# EAGLE design frdm (EAGLE 7.5.0)
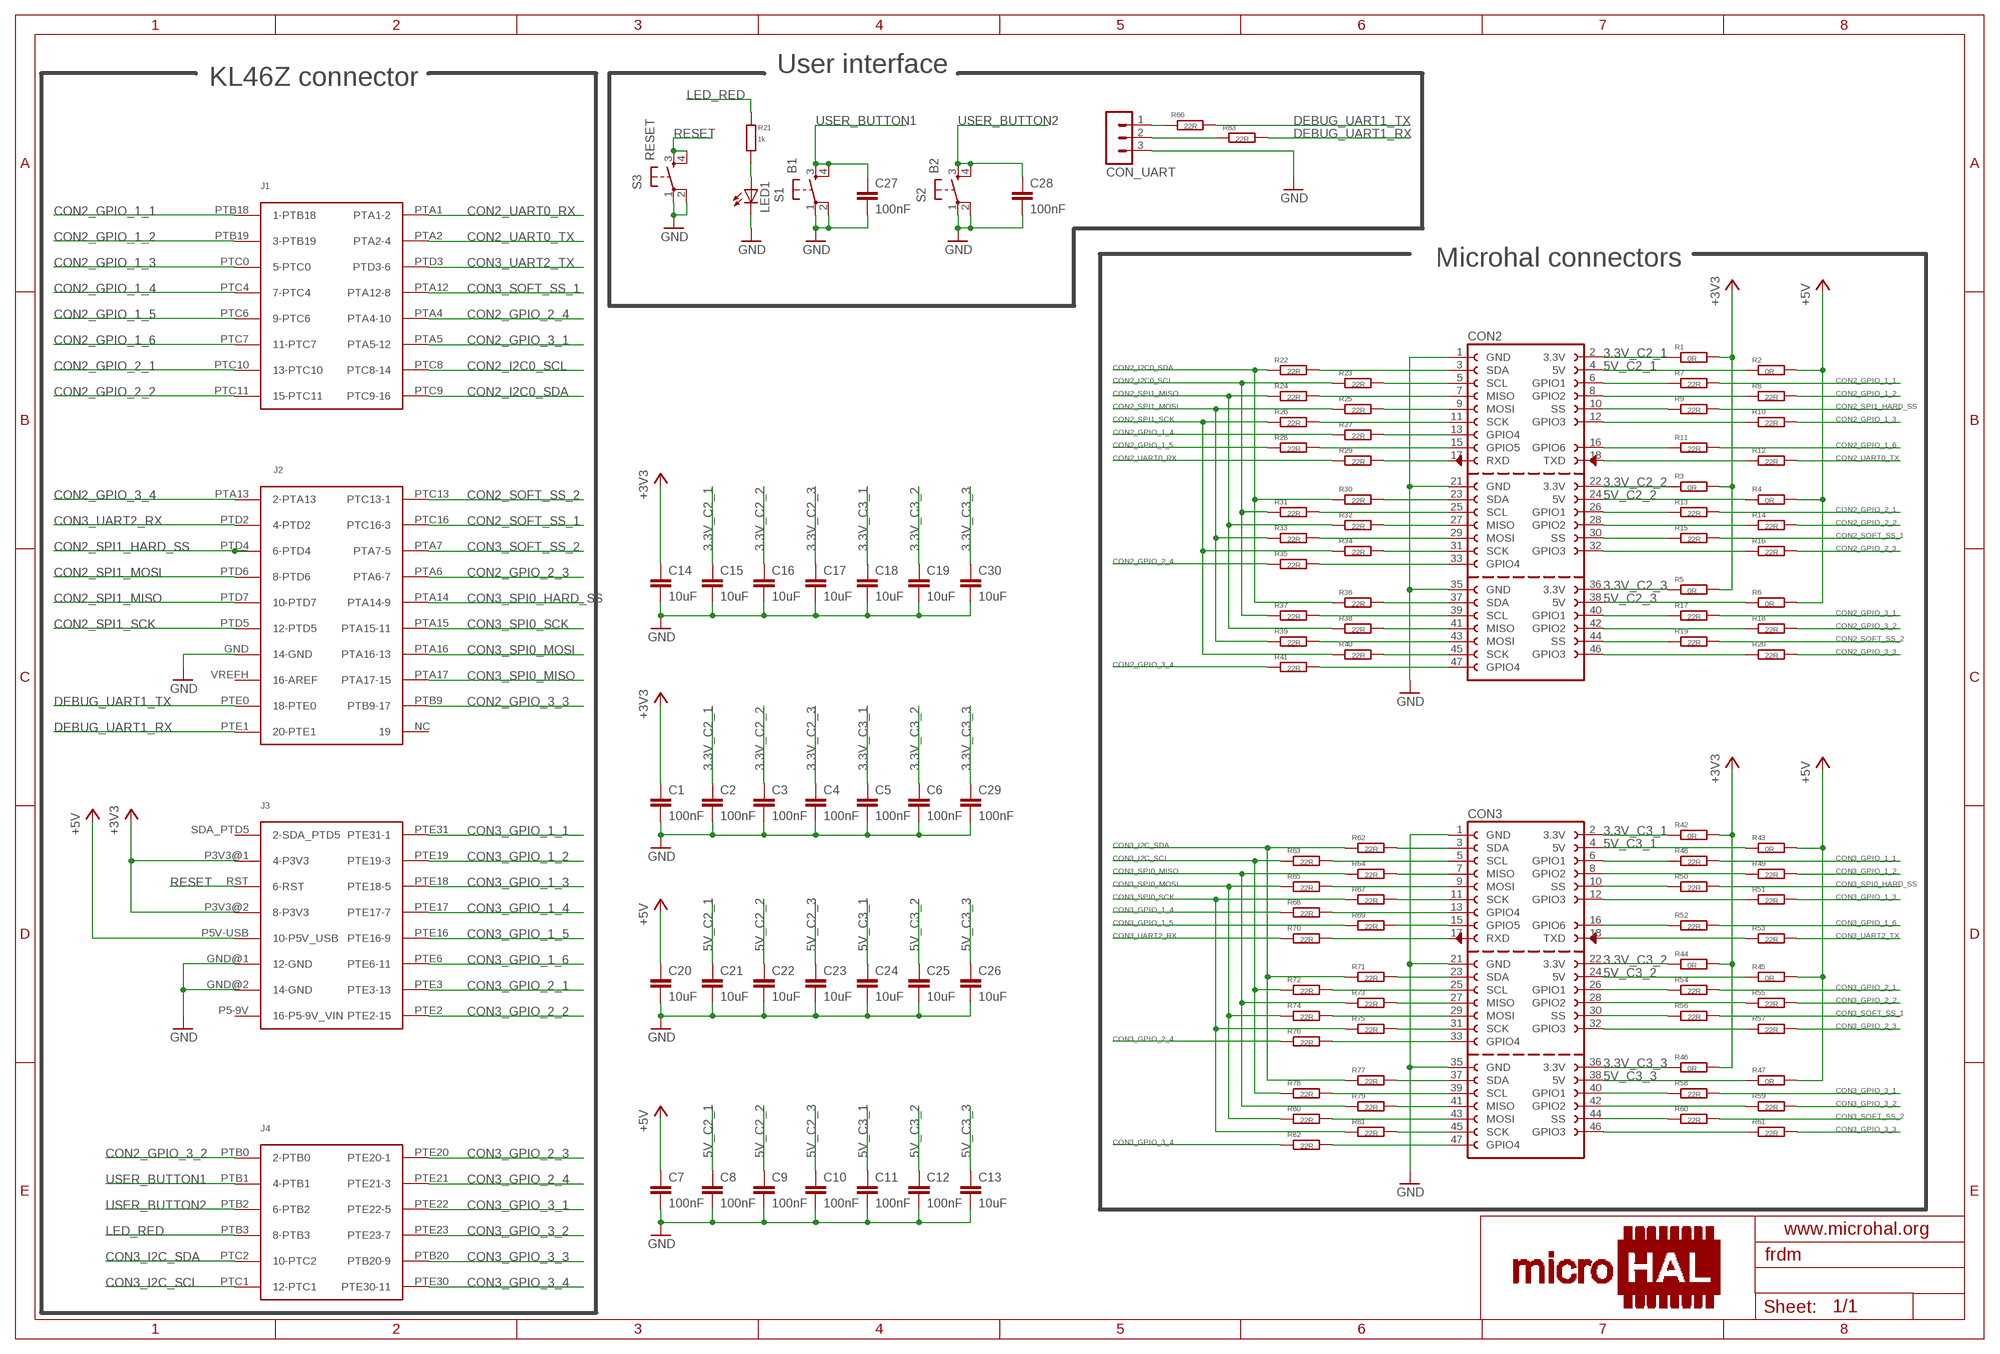
[diagram p0: schematic, sheet 1]

## Parts
C1  100nF  C-EUC0603K  [C0603K]
C2  100nF  C-EUC0603K  [C0603K]
C3  100nF  C-EUC0603K  [C0603K]
C4  100nF  C-EUC0603K  [C0603K]
C5  100nF  C-EUC0603K  [C0603K]
C6  100nF  C-EUC0603K  [C0603K]
C7  100nF  C-EUC0603K  [C0603K]
C8  100nF  C-EUC0603K  [C0603K]
C9  100nF  C-EUC0603K  [C0603K]
C10  100nF  C-EUC0603K  [C0603K]
C11  100nF  C-EUC0603K  [C0603K]
C12  100nF  C-EUC0603K  [C0603K]
C13  10uF  C-EUC0603K  [C0603K]
C14  10uF  C-EUC0603K  [C0603K]
C15  10uF  C-EUC0603K  [C0603K]
C16  10uF  C-EUC0603K  [C0603K]
C17  10uF  C-EUC0603K  [C0603K]
C18  10uF  C-EUC0603K  [C0603K]
C19  10uF  C-EUC0603K  [C0603K]
C20  10uF  C-EUC0603K  [C0603K]
C21  10uF  C-EUC0603K  [C0603K]
C22  10uF  C-EUC0603K  [C0603K]
C23  10uF  C-EUC0603K  [C0603K]
C24  10uF  C-EUC0603K  [C0603K]
C25  10uF  C-EUC0603K  [C0603K]
C26  10uF  C-EUC0603K  [C0603K]
C27  100nF  C-EUC0603K  [C0603K]
C28  100nF  C-EUC0603K  [C0603K]
C29  100nF  C-EUC0603K  [C0603K]
C30  10uF  C-EUC0603K  [C0603K]
CON1  FRDM_BASE  [FRDM_BASE]
CON2  MICROHAL_CONNECTOR_F_3  [MICROHAL_CONNECTOR_F_3]
CON3  MICROHAL_CONNECTOR_F_3  [MICROHAL_CONNECTOR_F_3]
CON_UART  MA03-1  [MA03-1]
LED1  LEDCHIPLED_0603  [CHIPLED_0603]
R1  0R  R-EU_R0603  [R0603]
R2  0R  R-EU_R0603  [R0603]
R3  0R  R-EU_R0603  [R0603]
R4  0R  R-EU_R0603  [R0603]
R5  0R  R-EU_R0603  [R0603]
R6  0R  R-EU_R0603  [R0603]
R7  22R  R-EU_R0603  [R0603]
R8  22R  R-EU_R0603  [R0603]
R9  22R  R-EU_R0603  [R0603]
R10  22R  R-EU_R0603  [R0603]
R11  22R  R-EU_R0603  [R0603]
R12  22R  R-EU_R0603  [R0603]
R13  22R  R-EU_R0603  [R0603]
R14  22R  R-EU_R0603  [R0603]
R15  22R  R-EU_R0603  [R0603]
R16  22R  R-EU_R0603  [R0603]
R17  22R  R-EU_R0603  [R0603]
R18  22R  R-EU_R0603  [R0603]
R19  22R  R-EU_R0603  [R0603]
R20  22R  R-EU_R0603  [R0603]
R21  1k  R-EU_R0603  [R0603]
R22  22R  R-EU_R0603  [R0603]
R23  22R  R-EU_R0603  [R0603]
R24  22R  R-EU_R0603  [R0603]
R25  22R  R-EU_R0603  [R0603]
R26  22R  R-EU_R0603  [R0603]
R27  22R  R-EU_R0603  [R0603]
R28  22R  R-EU_R0603  [R0603]
R29  22R  R-EU_R0603  [R0603]
R30  22R  R-EU_R0603  [R0603]
R31  22R  R-EU_R0603  [R0603]
R32  22R  R-EU_R0603  [R0603]
R33  22R  R-EU_R0603  [R0603]
R34  22R  R-EU_R0603  [R0603]
R35  22R  R-EU_R0603  [R0603]
R36  22R  R-EU_R0603  [R0603]
R37  22R  R-EU_R0603  [R0603]
R38  22R  R-EU_R0603  [R0603]
R39  22R  R-EU_R0603  [R0603]
R40  22R  R-EU_R0603  [R0603]
R41  22R  R-EU_R0603  [R0603]
R42  0R  R-EU_R0603  [R0603]
R43  0R  R-EU_R0603  [R0603]
R44  0R  R-EU_R0603  [R0603]
R45  0R  R-EU_R0603  [R0603]
R46  0R  R-EU_R0603  [R0603]
R47  0R  R-EU_R0603  [R0603]
R48  22R  R-EU_R0603  [R0603]
R49  22R  R-EU_R0603  [R0603]
R50  22R  R-EU_R0603  [R0603]
R51  22R  R-EU_R0603  [R0603]
R52  22R  R-EU_R0603  [R0603]
R53  22R  R-EU_R0603  [R0603]
R54  22R  R-EU_R0603  [R0603]
R55  22R  R-EU_R0603  [R0603]
R56  22R  R-EU_R0603  [R0603]
R57  22R  R-EU_R0603  [R0603]
R58  22R  R-EU_R0603  [R0603]
R59  22R  R-EU_R0603  [R0603]
R60  22R  R-EU_R0603  [R0603]
R61  22R  R-EU_R0603  [R0603]
R62  22R  R-EU_R0603  [R0603]
R63  22R  R-EU_R0603  [R0603]
R64  22R  R-EU_R0603  [R0603]
R65  22R  R-EU_R0603  [R0603]
R66  22R  R-EU_R0603  [R0603]
R67  22R  R-EU_R0603  [R0603]
R68  22R  R-EU_R0603  [R0603]
R69  22R  R-EU_R0603  [R0603]
R70  22R  R-EU_R0603  [R0603]
R71  22R  R-EU_R0603  [R0603]
R72  22R  R-EU_R0603  [R0603]
R73  22R  R-EU_R0603  [R0603]
R74  22R  R-EU_R0603  [R0603]
R75  22R  R-EU_R0603  [R0603]
R76  22R  R-EU_R0603  [R0603]
R77  22R  R-EU_R0603  [R0603]
R78  22R  R-EU_R0603  [R0603]
R79  22R  R-EU_R0603  [R0603]
R80  22R  R-EU_R0603  [R0603]
R81  22R  R-EU_R0603  [R0603]
R82  22R  R-EU_R0603  [R0603]
R83  22R  R-EU_R0603  [R0603]
S1  B1  SWITCH_TACT_6X6_SMD  [SWITCH_TACT_6X6_SMD]
S2  B2  SWITCH_TACT_6X6_SMD  [SWITCH_TACT_6X6_SMD]
S3  RESET  SWITCH_TACT_6X6_SMD  [SWITCH_TACT_6X6_SMD]

## Nets
3.3V_C2_1: C2.1 C15.1 CON2.2(3.3V) R1.1
3.3V_C2_2: C3.1 C16.1 CON2.22(3.3V) R3.1
3.3V_C2_3: C4.1 C17.1 CON2.36(3.3V) R5.1
3.3V_C3_1: C5.1 C18.1 CON3.2(3.3V) R42.1
3.3V_C3_2: C6.1 C19.1 CON3.22(3.3V) R44.1
3.3V_C3_3: C29.1 C30.1 CON3.36(3.3V) R46.1
5V_C2_1: C8.1 C21.1 CON2.4(5V) R2.1
5V_C2_2: C9.1 C22.1 CON2.24(5V) R4.1
5V_C2_3: C10.1 C23.1 CON2.38(5V) R6.1
5V_C3_1: C11.1 C24.1 CON3.4(5V) R43.1
5V_C3_2: C12.1 C25.1 CON3.24(5V) R45.1
5V_C3_3: C13.1 C26.1 CON3.38(5V) R47.1
+3V3: C1.1 C14.1 CON1.P3V3@1(4-P3V3) CON1.P3V3@2(8-P3V3) R1.2 R3.2 R5.2 R42.2 R44.2 R46.2
+5V: C7.1 C20.1 CON1.P5V-USB(10-P5V_USB) R2.2 R4.2 R6.2 R43.2 R45.2 R47.2
CON2_GPIO_1_1: CON1.PTB18(1-PTB18) R7.2
CON2_GPIO_1_2: CON1.PTB19(3-PTB19) R8.2
CON2_GPIO_1_3: CON1.PTC0(5-PTC0) R10.2
CON2_GPIO_1_4: CON1.PTC4(7-PTC4) R27.1
CON2_GPIO_1_5: CON1.PTC6(9-PTC6) R28.1
CON2_GPIO_1_6: CON1.PTC7(11-PTC7) R11.2
CON2_GPIO_2_1: CON1.PTC10(13-PTC10) R13.2
CON2_GPIO_2_2: CON1.PTC11(15-PTC11) R14.2
CON2_GPIO_2_3: CON1.PTA6(PTA6-7) R16.2
CON2_GPIO_2_4: CON1.PTA4(PTA4-10) R35.1
CON2_GPIO_3_1: CON1.PTA5(PTA5-12) R17.2
CON2_GPIO_3_2: CON1.PTB0(2-PTB0) R18.2
CON2_GPIO_3_3: CON1.PTB9(PTB9-17) R20.2
CON2_GPIO_3_4: CON1.PTA13(2-PTA13) R41.1
CON2_I2C0_SCL: CON1.PTC8(PTC8-14) R23.1 R31.1 R37.1
CON2_I2C0_SDA: CON1.PTC9(PTC9-16) R22.1 R30.1 R36.1
CON2_SOFT_SS_1: CON1.PTC16(PTC16-3) R15.2
CON2_SOFT_SS_2: CON1.PTC13(PTC13-1) R19.2
CON2_SPI1_HARD_SS: CON1.PTD4(6-PTD4) R9.2
CON2_SPI1_MISO: CON1.PTD7(10-PTD7) R24.1 R32.1 R38.1
CON2_SPI1_MOSI: CON1.PTD6(8-PTD6) R25.1 R33.1 R39.1
CON2_SPI1_SCK: CON1.PTD5(12-PTD5) R26.1 R34.1 R40.1
CON2_UART0_RX: CON1.PTA1(PTA1-2) R29.1
CON2_UART0_TX: CON1.PTA2(PTA2-4) R12.2
CON3_GPIO_1_1: CON1.PTE31(PTE31-1) R48.2
CON3_GPIO_1_2: CON1.PTE19(PTE19-3) R49.2
CON3_GPIO_1_3: CON1.PTE18(PTE18-5) R51.2
CON3_GPIO_1_4: CON1.PTE17(PTE17-7) R68.1
CON3_GPIO_1_5: CON1.PTE16(PTE16-9) R69.1
CON3_GPIO_1_6: CON1.PTE6(PTE6-11) R52.2
CON3_GPIO_2_1: CON1.PTE3(PTE3-13) R54.2
CON3_GPIO_2_2: CON1.PTE2(PTE2-15) R55.2
CON3_GPIO_2_3: CON1.PTE20(PTE20-1) R57.2
CON3_GPIO_2_4: CON1.PTE21(PTE21-3) R76.1
CON3_GPIO_3_1: CON1.PTE22(PTE22-5) R58.2
CON3_GPIO_3_2: CON1.PTE23(PTE23-7) R59.2
CON3_GPIO_3_3: CON1.PTB20(PTB20-9) R61.2
CON3_GPIO_3_4: CON1.PTE30(PTE30-11) R82.1
CON3_I2C_SCL: CON1.PTC1(12-PTC1) R63.1 R72.1 R78.1
CON3_I2C_SDA: CON1.PTC2(10-PTC2) R62.1 R71.1 R77.1
CON3_SOFT_SS_1: CON1.PTA12(PTA12-8) R56.2
CON3_SOFT_SS_2: CON1.PTA7(PTA7-5) R60.2
CON3_SPI0_HARD_SS: CON1.PTA14(PTA14-9) R50.2
CON3_SPI0_MISO: CON1.PTA17(PTA17-15) R64.1 R73.1 R79.1
CON3_SPI0_MOSI: CON1.PTA16(PTA16-13) R65.1 R74.1 R80.1
CON3_SPI0_SCK: CON1.PTA15(PTA15-11) R67.1 R75.1 R81.1
CON3_UART2_RX: CON1.PTD2(4-PTD2) R70.1
CON3_UART2_TX: CON1.PTD3(PTD3-6) R53.2
DEBUG_UART1_RX: CON1.PTE1(20-PTE1) R83.2
DEBUG_UART1_TX: CON1.PTE0(18-PTE0) R66.2
GND: C1.2 C2.2 C3.2 C4.2 C5.2 C6.2 C7.2 C8.2 C9.2 C10.2 C11.2 C12.2 C13.2 C14.2 C15.2 C16.2 C17.2 C18.2 C19.2 C20.2 C21.2 C22.2 C23.2 C24.2 C25.2 C26.2 C27.2 C28.2 C29.2 C30.2 CON1.GND(14-GND) CON1.GND@1(12-GND) CON1.GND@2(14-GND) CON2.1(GND) CON2.21(GND) CON2.35(GND) CON3.1(GND) CON3.21(GND) CON3.35(GND) CON_UART.3 LED1.C S1.1 S1.2 S2.1 S2.2 S3.1 S3.2
LED_RED: CON1.PTB3(8-PTB3) R21.2
N$1: CON2.7(MISO) R24.2
N$10: CON2.6(GPIO1) R7.1
N$12: CON2.8(GPIO2) R8.1
N$16: CON3.9(MOSI) R65.2
N$17: CON3.5(SCL) R63.2
N$18: CON3.13(GPIO4) R68.2
N$19: CON3.11(SCK) R67.2
N$20: CON3.15(GPIO5) R69.2
N$21: CON2.10(SS) R9.1
N$22: CON2.12(GPIO3) R10.1
N$23: CON2.16(GPIO6) R11.1
N$24: CON3.7(MISO) R64.2
N$25: CON2.18(TXD) R12.1
N$26: CON2.26(GPIO1) R13.1
N$27: CON3.6(GPIO1) R48.1
N$28: CON2.28(GPIO2) R14.1
N$29: CON2.30(SS) R15.1
N$30: CON2.32(GPIO3) R16.1
N$31: CON_UART.1 R66.1
N$32: CON_UART.2 R83.1
N$33: CON3.8(GPIO2) R49.1
N$34: CON2.40(GPIO1) R17.1
N$35: CON2.44(SS) R19.1
N$36: CON2.42(GPIO2) R18.1
N$37: CON2.46(GPIO3) R20.1
N$38: CON3.10(SS) R50.1
N$40: CON3.12(GPIO3) R51.1
N$42: CON3.16(GPIO6) R52.1
N$44: CON3.18(TXD) R53.1
N$46: CON3.26(GPIO1) R54.1
N$48: CON3.30(SS) R56.1
N$49: CON3.28(GPIO2) R55.1
N$50: CON3.32(GPIO3) R57.1
N$51: CON2.47(GPIO4) R41.2
N$52: CON2.45(SCK) R40.2
N$53: CON2.43(MOSI) R39.2
N$54: CON2.41(MISO) R38.2
N$55: CON2.39(SCL) R37.2
N$56: CON2.37(SDA) R36.2
N$57: CON2.33(GPIO4) R35.2
N$58: CON2.31(SCK) R34.2
N$59: CON2.29(MOSI) R33.2
N$60: CON2.27(MISO) R32.2
N$61: CON2.25(SCL) R31.2
N$62: CON2.23(SDA) R30.2
N$63: CON2.17(RXD) R29.2
N$64: CON2.13(GPIO4) R27.2
N$65: CON2.9(MOSI) R25.2
N$66: CON2.5(SCL) R23.2
N$67: CON2.3(SDA) R22.2
N$68: CON2.11(SCK) R26.2
N$69: CON2.15(GPIO5) R28.2
N$72: CON3.40(GPIO1) R58.1
N$74: CON3.42(GPIO2) R59.1
N$77: CON3.44(SS) R60.1
N$78: CON3.46(GPIO3) R61.1
N$80: CON3.47(GPIO4) R82.2
N$81: CON3.45(SCK) R81.2
N$82: CON3.43(MOSI) R80.2
N$83: CON3.41(MISO) R79.2
N$84: CON3.39(SCL) R78.2
N$85: CON3.37(SDA) R77.2
N$86: CON3.33(GPIO4) R76.2
N$87: CON3.31(SCK) R75.2
N$88: CON3.29(MOSI) R74.2
N$89: CON3.27(MISO) R73.2
N$90: CON3.25(SCL) R72.2
N$91: CON3.23(SDA) R71.2
N$92: CON3.17(RXD) R70.2
N$93: CON3.3(SDA) R62.2
N$103: LED1.A R21.1
RESET: CON1.RST(6-RST) S3.3 S3.4
USER_BUTTON1: C27.1 CON1.PTB1(4-PTB1) S1.3 S1.4
USER_BUTTON2: C28.1 CON1.PTB2(6-PTB2) S2.3 S2.4
Unconnected: CON1.NC CON1.P5-9V(16-P5-9V_VIN) CON1.SDA_PTD5(2-SDA_PTD5) CON1.VREFH(16-AREF)

## Notes on the sheet
- User interface
- KL46Z connector
- Microhal connectors

## Library data of the parts
C1-C30 = rcl:C-EU: CAPACITOR, European symbol
CON1 = frdm_lib:FRDM_BASE
CON2 CON3 = microhal-connector_v0.1:MICROHAL_CONNECTOR_F_3: Connector used in microhal development board.
CON_UART = con-lstb:MA03-1: PIN HEADER; OC_FARNELL: unknown; OC_NEWARK: unknown
LED1 = led:LED: LED OSRAM: - CHIPLED LG R971, LG N971, LY N971, LG Q971, LY Q971, LO R971, LY R971 LH N974, LH R974 LS Q976, LO Q976, LY Q976 LO Q996 - Hyper CHIPLED LW Q18S LB Q993, LB Q99A, LB R99A - SideLED LS A670, LO A670, LY A670, LG A670, LP A670 LB A673, LV A673, LT A673, LW A673 LH A674 LY A675 LS A676, LA A676, LO A676, LY A676, LW A676 LS A679, LY A679, LG A679 - Hyper Micro SIDELED® LS Y876, LA Y876, LO Y876, LY Y876 LT Y87S - SmartLED LW L88C, LW L88S LB L89C, LB L89S, LG L890 LS L89K, LO L89K, LY L89K LS L896, LA L896, LO L896, LY L896 - TOPLED LS T670, LO T670, LY T670, LG T670, LP T670 LSG T670, LSP T670, LSY T670, LOP T670, LYG T670 LG T671, LOG T671, LSG T671 LB T673, LV T673, LT T673, LW T673 LH T674 LS T676, LA T676, LO T676, LY T676, LB T676, LH T676, LSB T676, LW T676 LB T67C, LV T67C, LT T67C, LS T67K, LO T67K, LY T67K, LW E67C LS E67B, LA E67B, LO E67B, LY E67B, LB E67C, LV E67C, LT E67C LW T67C LS T679, LY T679, LG T679 LS T770, LO T770, LY T770, LG T770, LP T770 LB T773, LV T773, LT T773, LW T773 LH T774 LS E675, LA E675, LY E675, LS T675 LS T776, LA T776, LO T776, LY T776, LB T776 LHGB T686 LT T68C, LB T68C - Hyper Mini TOPLED® LB M676 - Mini TOPLED Santana® LG M470 LS M47K, LO M47K, LY M47K Source: http://www.osram.convergy.de LUXEON: - LUMILED® LXK2-PW12-R00, LXK2-PW12-S00, LXK2-PW14-U00, LXK2-PW14-V00 LXK2-PM12-R00, LXK2-PM12-S00, LXK2-PM14-U00 LXK2-PE12-Q00, LXK2-PE12-R00, LXK2-PE12-S00, LXK2-PE14-T00, LXK2-PE14-U00 LXK2-PB12-K00, LXK2-PB12-L00, LXK2-PB12-M00, LXK2-PB14-N00, LXK2-PB14-P00, LXK2-PB14-Q00 LXK2-PR12-L00, LXK2-PR12-M00, LXK2-PR14-Q00, LXK2-PR14-R00 LXK2-PD12-Q00, LXK2-PD12-R00, LXK2-PD12-S00 LXK2-PH12-R00, LXK2-PH12-S00 LXK2-PL12-P00, LXK2-PL12-Q00, LXK2-PL12-R00 Source: www.luxeon.com KINGBRIGHT: KA-3528ASYC Source: www.kingbright.com
R1-R83 = rcl:R-EU_: RESISTOR, European symbol
S1-S3 = frdm_lib:SWITCH_TACT_6X6_SMD

## Board
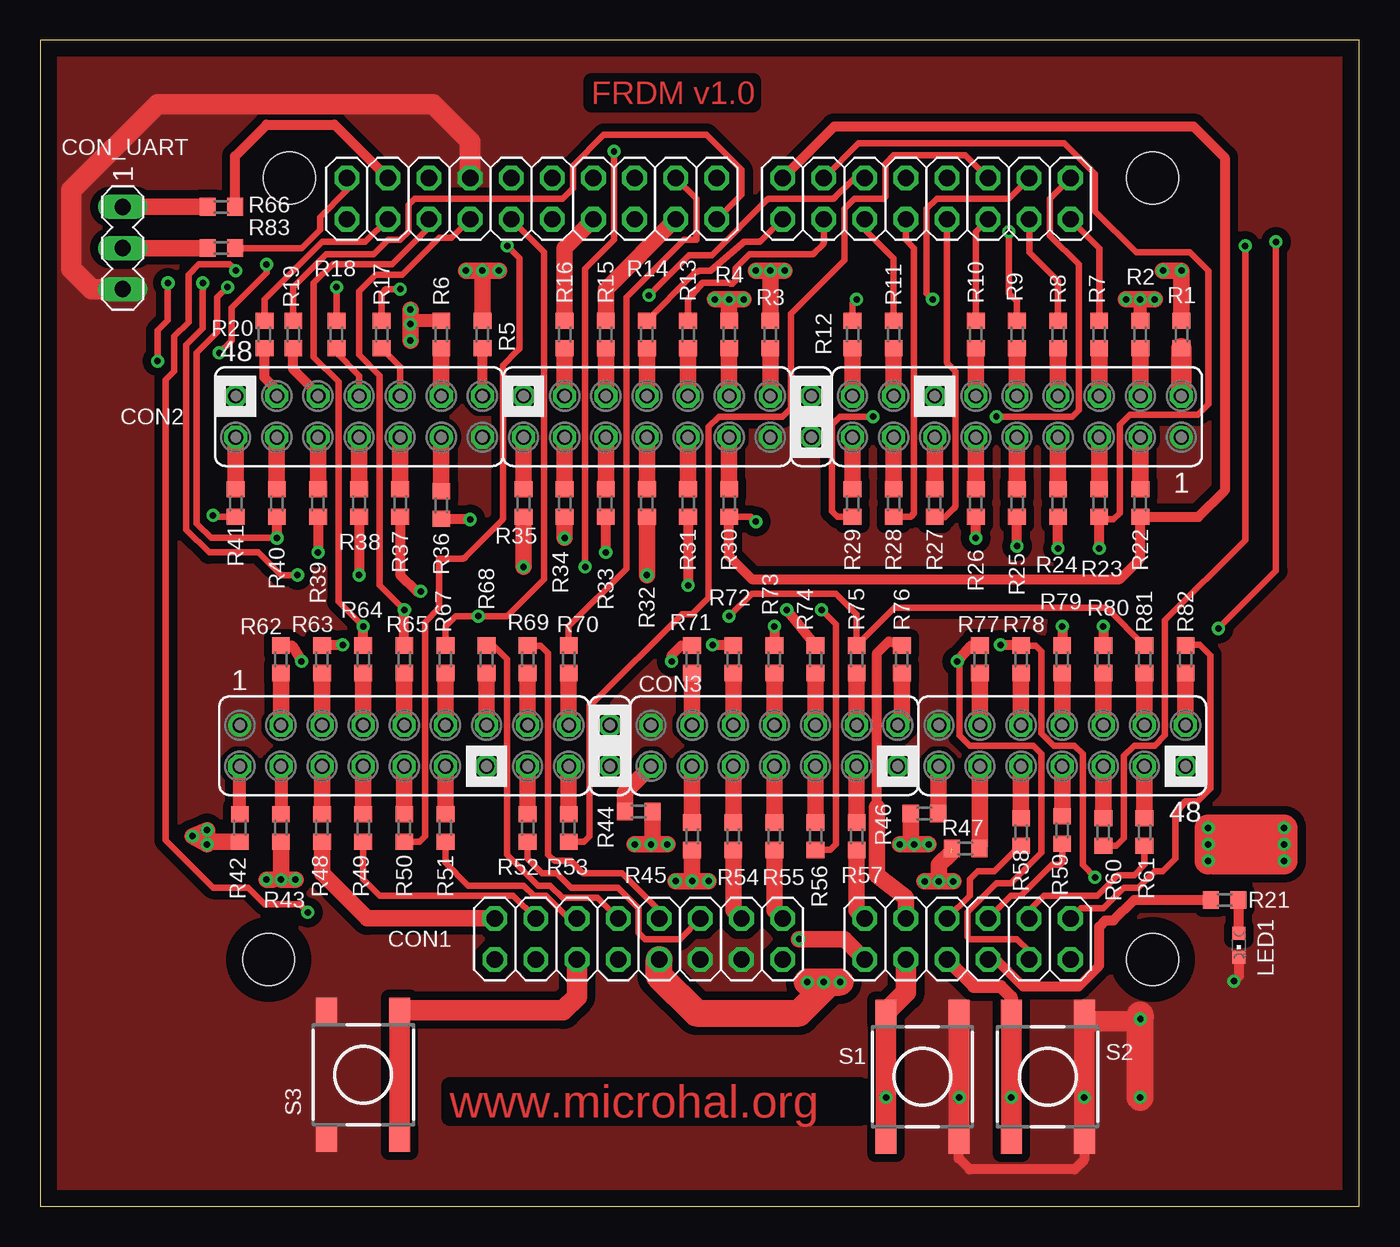
[diagram p1: board, top side]
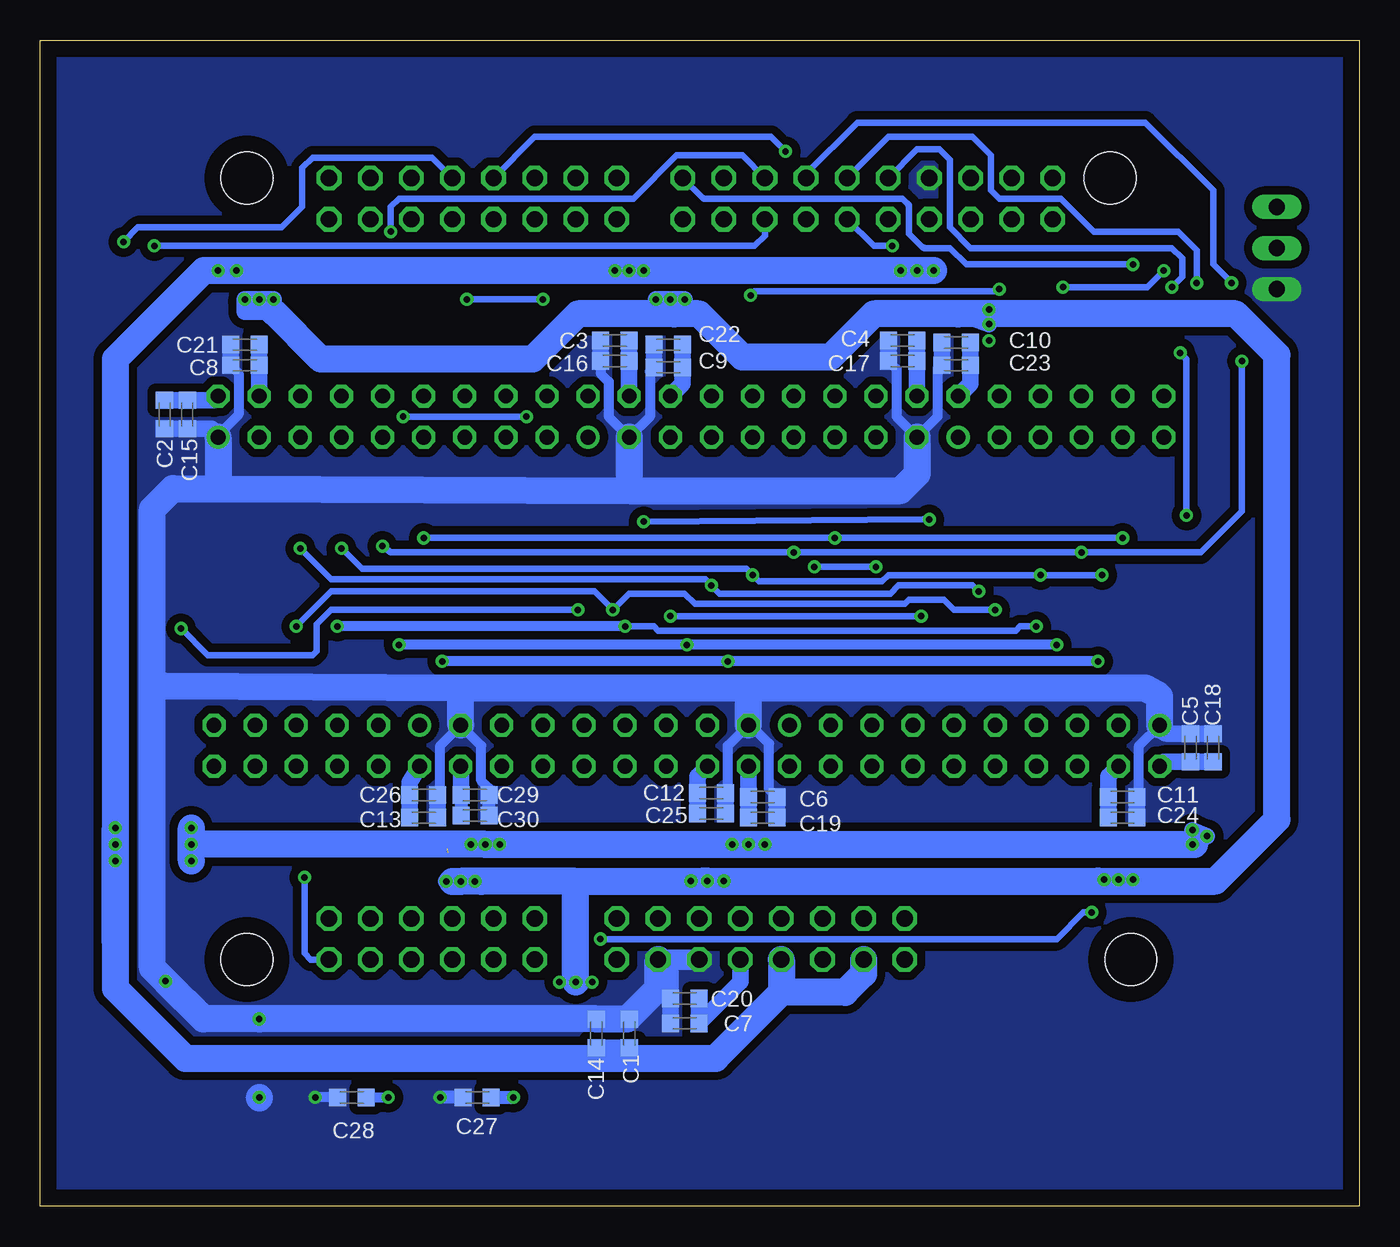
[diagram p2: board, bottom side, seen from below]

Size 81.46 x 72 mm. Coordinates in mm from the lower left corner, seen from the top.
Outline: 0,0 81.46,0 81.46,72 0,72 0,0
Copper layers (1*16): Top 0.035mm / dielectric 1.5mm / Bottom 0.035mm
Design rules "default *": minimum track width 10mil, minimum drill 15mil, track to track 8mil, track to pad 8mil, pad to pad 8mil, via to via 8mil, smd to smd 8mil, copper to edge 40mil, drill to drill 8mil, minimum pad ring 10mil, minimum via ring 8mil, stop-mask expansion 4mil, vias tented up to drill 0mil, thermal gap 10mil

### Footprints (pad centres in the part's own frame; a part is rotated, then mirrored left to right if it is on the bottom)
C0603K = smd 1.05 x 1.08: 1 -0.875,0; 2 0.875,0
FRDM_BASE = drill 1.016 octagon: GND -31.496,46.99; GND@1 -17.272,-1.27; GND@2 -14.732,-1.27; NC -39.116,44.45; P3V3@1 -22.352,-1.27; P3V3@2 -27.432,-1.27; P5-9V -12.192,-1.27; P5V-USB -19.812,-1.27; PTA1 5.588,46.99; PTA2 3.048,46.99; PTA4 -4.572,46.99; PTA5 -7.112,46.99; PTA6 -23.876,44.45; PTA7 -21.336,44.45; PTA12 -2.032,46.99; PTA13 -16.256,46.99; PTA14 -26.416,44.45; PTA15 -28.956,44.45; PTA16 -31.496,44.45; PTA17 -34.036,44.45; PTB0 -7.112,-1.27; PTB1 -4.572,-1.27; PTB2 -2.032,-1.27; PTB3 0.508,-1.27; PTB9 -36.576,44.45; PTB18 5.588,44.45; PTB19 3.048,44.45; PTB20 3.048,1.27; PTC0 0.508,44.45; PTC1 5.588,-1.27; PTC2 3.048,-1.27; PTC4 -2.032,44.45; PTC6 -4.572,44.45; PTC7 -7.112,44.45; PTC8 -9.652,46.99; PTC9 -12.192,46.99; PTC10 -9.652,44.45; PTC11 -12.192,44.45; PTC13 -16.256,44.45; PTC16 -18.796,44.45; PTD2 -18.796,46.99; PTD3 0.508,46.99; PTD4 -21.336,46.99; PTD5 -28.956,46.99; PTD6 -23.876,46.99; PTD7 -26.416,46.99; PTE0 -36.576,46.99; PTE1 -39.116,46.99; PTE2 -12.192,1.27; PTE3 -14.732,1.27; PTE6 -17.272,1.27; PTE16 -19.812,1.27; PTE17 -22.352,1.27; PTE18 -24.892,1.27; PTE19 -27.432,1.27; PTE20 -7.112,1.27; PTE21 -4.572,1.27; PTE22 -2.032,1.27; PTE23 0.508,1.27; PTE30 5.588,1.27; PTE31 -29.972,1.27; RST -24.892,-1.27; SDA_PTD5 -29.972,-1.27; VREFH -34.036,46.99 | hole 3.2: -42.672,46.99; -43.942,-1.27; 10.668,46.99; 10.668,-1.27
MICROHAL_CONNECTOR_F_3 = drill 0.914: 1 -33.02,1.27; 19 -10.16,1.27; 37 12.7,1.27 | drill 0.914 octagon: 2 -33.02,-1.27; 3 -30.48,1.27; 4 -30.48,-1.27; 5 -27.94,1.27; 6 -27.94,-1.27; 7 -25.4,1.27; 8 -25.4,-1.27; 9 -22.86,1.27; 10 -22.86,-1.27; 11 -20.32,1.27; 12 -20.32,-1.27; 13 -17.78,1.27; 14 -17.78,-1.27; 15 -15.24,1.27; 16 -15.24,-1.27; 17 -12.7,1.27; 18 -12.7,-1.27; 20 -10.16,-1.27; 21 -7.62,1.27; 22 -7.62,-1.27; 23 -5.08,1.27; 24 -5.08,-1.27; 25 -2.54,1.27; 26 -2.54,-1.27; 27 0,1.27; 28 0,-1.27; 29 2.54,1.27; 30 2.54,-1.27; 31 5.08,1.27; 32 5.08,-1.27; 33 7.62,1.27; 34 7.62,-1.27; 35 10.16,1.27; 36 10.16,-1.27; 38 12.7,-1.27; 39 15.24,1.27; 40 15.24,-1.27; 41 17.78,1.27; 42 17.78,-1.27; 43 20.32,1.27; 44 20.32,-1.27; 45 22.86,1.27; 46 22.86,-1.27; 47 25.4,1.27; 48 25.4,-1.27
MA03-1 = drill 1.016 long: 1 -2.54,0; 2 0,0; 3 2.54,0
CHIPLED_0603 = smd 0.8 x 0.8: A 0,-0.75; C 0,0.75
R0603 = smd 1 x 1.1: 1 -0.85,0; 2 0.85,0
SWITCH_TACT_6X6_SMD = smd 1.55 x 1.3: 1 -3.975,2.25; 2 3.975,2.25; 3 -3.975,-2.25; 4 3.975,-2.25

### Placement (x,y rotation side)
C1  45.09,10.67 90 bottom
C2  73.79,48.9 270 bottom
C3  45.97,53.47 180 bottom
C4  28.19,53.47 180 bottom
C5  10.41,28.32 90 bottom
C6  36.83,25.27 0 bottom
C7  41.66,11.3 180 bottom
C8  68.83,51.94 180 bottom
C9  42.67,51.82 180 bottom
C10  24.89,53.34 180 bottom
C11  14.61,25.27 0 bottom
C12  40.01,25.53 0 bottom
C13  57.78,24 0 bottom
C14  47.12,10.67 90 bottom
C15  72.39,48.9 270 bottom
C16  45.97,52.2 180 bottom
C17  28.19,52.2 180 bottom
C18  9.02,28.32 90 bottom
C19  36.83,24 0 bottom
C20  41.66,12.83 180 bottom
C21  68.83,53.21 180 bottom
C22  42.67,53.21 180 bottom
C23  24.89,51.94 180 bottom
C24  14.61,24 0 bottom
C25  40.01,24.26 0 bottom
C26  57.78,25.4 0 bottom
C27  54.48,6.73 180 bottom
C28  62.23,6.73 180 bottom
C29  54.61,25.4 0 bottom
C30  54.61,24.13 0 bottom
CON1  58.04,16.51 0 top
CON2  37.46,48.77 180 top
CON3  45.34,28.45 0 top
CON_UART  5.08,59.18 270 top
LED1  74.04,16.13 180 top
R1  70.48,53.85 90 top
R2  67.94,53.85 90 top
R3  45.09,53.85 90 top
R4  42.55,53.85 90 top
R5  27.3,53.85 90 top
R6  24.77,53.85 90 top
R7  65.41,53.85 90 top
R8  62.86,53.85 90 top
R9  60.33,53.85 90 top
R10  57.78,53.85 90 top
R11  52.7,53.85 90 top
R12  50.16,53.85 90 top
R13  40.01,53.85 90 top
R14  37.46,53.85 90 top
R15  34.92,53.85 90 top
R16  32.38,53.85 90 top
R17  21.08,53.85 90 top
R18  18.29,53.85 90 top
R19  15.62,53.85 90 top
R20  13.84,53.85 90 top
R21  73.15,18.92 180 top
R22  67.94,43.43 90 top
R23  65.41,43.43 90 top
R24  62.86,43.43 90 top
R25  60.33,43.43 90 top
R26  57.78,43.43 90 top
R27  55.25,43.43 90 top
R28  52.7,43.43 90 top
R29  50.16,43.43 90 top
R30  42.55,43.43 90 top
R31  40.01,43.43 90 top
R32  37.46,43.43 90 top
R33  34.92,43.43 90 top
R34  32.38,43.43 90 top
R35  29.84,43.43 90 top
R36  24.77,43.31 90 top
R37  22.22,43.43 90 top
R38  19.68,43.43 90 top
R39  17.14,43.43 90 top
R40  14.61,43.43 90 top
R41  12.06,43.43 90 top
R42  12.32,23.37 270 top
R43  14.86,23.37 270 top
R44  36.96,24.38 0 top
R45  40.26,22.86 270 top
R46  54.61,24.26 180 top
R47  57.15,22.1 180 top
R48  17.4,23.37 270 top
R49  19.94,23.37 270 top
R50  22.48,23.37 270 top
R51  25.02,23.37 270 top
R52  30.1,23.37 270 top
R53  32.64,23.37 270 top
R54  42.8,22.86 270 top
R55  45.34,22.86 270 top
R56  47.88,22.86 270 top
R57  50.42,22.86 270 top
R58  60.58,23.11 270 top
R59  63.12,23.24 270 top
R60  65.66,23.11 270 top
R61  68.2,23.11 270 top
R62  14.86,33.78 270 top
R63  17.4,33.78 270 top
R64  19.94,33.78 270 top
R65  22.48,33.78 270 top
R66  11.18,61.72 0 top
R67  25.02,33.78 270 top
R68  27.56,33.78 270 top
R69  30.1,33.78 270 top
R70  32.64,33.78 270 top
R71  40.26,33.78 270 top
R72  42.8,33.78 270 top
R73  45.34,33.78 270 top
R74  47.88,33.78 270 top
R75  50.42,33.78 270 top
R76  53.21,33.78 270 top
R77  58.04,33.78 270 top
R78  60.58,33.78 270 top
R79  63.12,33.78 270 top
R80  65.66,33.78 270 top
R81  68.2,33.78 270 top
R82  70.74,33.78 270 top
R83  11.18,59.18 0 top
S1  54.48,8 270 top
S2  62.23,8 270 top
S3  19.94,8.13 90 top

### Tracks (layer width: path | path; a pad name or v marks a point on that pad's centre or on a via)
3.3V_C2_1
  Top 1.27: R1.1 CON2.2
  Bottom 1.016: CON2.2 70.75,49.77 C15.1 C2.1
3.3V_C2_2
  Top 1.016: CON2.22 R3.1
  Bottom 1.016: CON2.22 45.09,52.18 C16.1 C3.1
3.3V_C2_3
  Top 0.61: CON2.36 R5.1
  Bottom 1.016: CON2.36 27.3,52.18 C17.1 C4.1
3.3V_C3_1
  Top 0.813: R42.1 CON3.2
  Bottom 1.016: C18.1 C5.1 12.05,27.45 CON3.2
3.3V_C3_2
  Top 1.016: R44.1 36.11,25.57 CON3.22
  Bottom 1.016: CON3.22 37.7,27.16 C6.1 C19.1
3.3V_C3_3
  Top 1.016: R46.1 55.46,27.18 CON3.36
  Bottom 0.813: C29.1 55.48,25.23 C30.1
  Bottom 1.016: 55.48,25.23 55.48,27.16 CON3.36
5V_C2_1
  Top 1.016: CON2.4 R2.1
  Bottom 1.016: CON2.4 67.96,50.05 C8.1 C21.1
5V_C2_2
  Top 1.016: R4.1 CON2.24
  Bottom 1.016: C22.1 C9.1 41.8,50.79 CON2.24
5V_C2_3
  Top 1.016: CON2.38 R6.1
  Bottom 1.016: C10.1 C23.1 24.02,50.79 CON2.38
5V_C3_1
  Top 0.813: CON3.4 R43.1
  Bottom 1.016: C24.1 C11.1 15.48,26.56 CON3.4
5V_C3_2
  Top 1.016: R45.1 CON3.24
  Bottom 1.016: C12.1 C25.1 40.88,26.56 CON3.24
5V_C3_3
  Top 1.016: R47.1 58.04,22.39 CON3.38
  Bottom 1.016: C26.1 C13.1 58.66,26.18 CON3.38
+3V3  (via drill 0.4)
  Top 1.016: R1.2 v70.48,57.78 v69.34,57.78 | R3.2 v45.09,57.78 | v45.97,57.78 v44.2,57.78 | R5.2 v27.3,57.78 | v28.32,57.78 v26.29,57.78 | R44.2 37.81,22.35 | 37.81,22.35 v37.72,22.35 v36.7,22.35 | 37.81,22.35 v38.73,22.35 | v53.98,22.35 53.76,22.57 R46.2 | v53.09,22.35 v53.98,22.35 | v54.86,22.35 v53.98,22.35 | R42.2 10.45,22.52 v10.29,22.35 | v10.29,22.35 v10.29,23.24 v9.4,22.86 v10.29,22.35
  Top 1.676: v76.83,22.35 v76.83,21.34 72.52,21.34 72.52,22.48 | v76.83,22.35 v76.83,23.37 v72.14,23.37 v72.14,22.35 | v72.14,21.34 v72.14,22.35 | v72.14,22.35 v76.83,22.35
  Bottom 0.254: 39.75,9.14 39.79,9.19 45.09,9.19
  Bottom 0.406: C1.1 45.09,9.19 | C14.1 47.12,9.2
  Bottom 1.016: C1.1 C14.1 | v9.4,22.86 v10.29,22.35 v10.29,23.24 v9.4,22.86
  Bottom 1.676: v26.29,57.78 v27.3,57.78 v28.32,57.78 v44.2,57.78 v45.09,57.78 v45.97,57.78 v69.34,57.78 v70.48,57.78 71.37,57.78 76.83,52.32 v76.83,23.37 | 76.83,16.26 v76.83,21.34 | v76.83,21.34 v76.83,23.37 | v76.83,23.37 v76.83,22.35 v76.83,21.34 | v72.14,21.34 v72.14,22.35 | v72.14,22.35 v72.14,23.37 | CON1.P3V3@2 30.61,14.35 31.75,13.21 35.56,13.21 | 35.56,13.21 35.69,13.21 39.75,9.14 72.52,9.14 76.83,13.46 v76.83,21.34 | v72.14,22.35 v53.98,22.35 v37.72,22.35 v10.29,22.35 10.16,22.35 | CON1.P3V3@1 35.69,13.34 35.56,13.21
+5V  (via drill 0.4)  (1 unrouted)
  Top 0.406: R43.2 14.69,22.35 14.61,22.35
  Top 0.813: R2.2 v67.94,56.01 | R6.2 23.07,54.7 v22.86,54.48
  Top 1.016: R45.2 v40.26,20.09 | v39.24,20.09 v40.26,20.09 | v41.27,20.09 v40.26,20.09 | v56.39,20.07 v55.5,20.07 | v55.5,20.07 v54.61,20.07 | v55.5,20.07 55.5,21.08 56.26,21.84 | R43.2 v14.86,20.18 v15.75,20.18 | v13.97,20.18 14.35,20.18 | v67.06,56.01 v67.94,56.01 v68.83,56.01 | R4.2 v42.55,56.01 | v41.66,56.01 v42.55,56.01 | v43.43,56.01 v42.55,56.01 | v22.86,53.47 v22.86,54.48 v22.86,55.37
  Top 1.676: v47.37,13.84 v49.4,13.84 v48.39,13.84 48.39,13.46 46.86,11.94 40.51,11.94 38.23,14.22 CON1.P5V-USB
  Bottom 0.406: 67.06,55.24 67.4,55.24
  Bottom 0.813: 16.13,20.09 16.04,20.18 14.73,20.18 v13.97,20.18
  Bottom 1.016: v40.26,20.09 40.38,20.09 40.51,20.09 | v55.5,20.07 v56.39,20.07 54.99,20.07 54.86,19.94 54.36,19.94 54.23,20.07 53.59,20.07 53.47,20.19 53.34,20.19 | v14.86,20.18 14.73,20.18 | v68.83,56.01 68.07,56.01 | 68.07,56.01 v67.94,56.01 v67.06,56.01 67.06,55.24 | v42.55,56.01 42.55,55.37 42.29,55.12 | v41.66,56.01 v42.55,56.01 | v42.55,56.01 v43.43,56.01 | v22.86,54.48 24.77,55.12 | C20.1 C7.1 38.23,13.86 CON1.P5V-USB | 67.4,55.24 68.71,55.24 68.71,55.75 68.83,55.75 v68.83,56.01 | v68.83,56.01 68.83,55.24 68.07,55.24 68.07,56.01
  Bottom 1.676: v48.39,13.84 48.39,20.07 | 48.39,20.07 54.23,20.07 v55.5,20.07 56.01,20.07 | 48.39,20.07 40.51,20.09 v40.26,20.09 16.13,20.09 8.86,20.09 5.08,23.88 5.08,52.58 7.62,55.12 24.77,55.12 29.87,55.12 arc-45 30.05,55.04 32.56,52.52 arc45 32.74,52.45 38.1,52.45 40.69,55.04 arc-45 40.87,55.12 42.29,55.12 48.26,55.12 51.05,52.32 64.14,52.32 67.06,55.24
CON2_GPIO_1_1
  Top 0.406: R7.2 65.41,59.18 CON1.PTB18
CON2_GPIO_1_2
  Top 0.406: R8.2 62.86,57.15 61.09,58.93 CON1.PTB19
CON2_GPIO_1_3
  Top 0.406: R10.2 57.78,60.2 CON1.PTC0
CON2_GPIO_1_4
  Top 0.406: CON1.PTC4 56.01,52.17 arc45 56.08,52 56.52,51.56 56.52,43.28 arc-45 56.44,43.11 55.88,42.55 55.34,42.55 arc-45 R27.1
CON2_GPIO_1_5
  Top 0.406: R28.1 53.76,42.58 53.98,42.8 53.98,59.18 53.47,59.69 CON1.PTC6
CON2_GPIO_1_6
  Top 0.406: R11.2 52.7,58.55 50.93,60.33 CON1.PTC7
CON2_GPIO_2_1
  Top 0.406: R13.2 40.01,55.9 arc-45 40.08,56.08 40.89,57.02 42.57,57.02 arc45 42.75,56.97 42.93,57.15 42.93,57.81 arc-45 43,57.99 43.81,58.8 47.65,58.8 arc45 47.83,58.88 48.31,59.36 arc45 48.39,59.54 CON1.PTC10
CON2_GPIO_2_2
  Top 0.406: R14.2 40.22,57.46 arc-45 40.78,57.78 41.4,57.78 43.36,59.49 arc-45 43.54,59.56 44.34,59.56 arc45 44.52,59.64 CON1.PTC11
CON2_GPIO_2_3
  Top 0.406: R16.2 32.38,54.61
  Top 1.016: R16.2 32.38,59.18 CON1.PTA6
CON2_GPIO_2_4  (via drill 0.4)
  Top 0.406: v33.66,39.5 33.66,57.91 35.43,59.69 v35.43,65.15
  Top 1.016: v29.84,39.5 R35.1
  Bottom 0.406: CON1.PTA4 50.93,66.04 36.32,66.04 v35.43,65.15 | v33.66,39.5 v29.84,39.5
CON2_GPIO_3_1  (via drill 0.4)
  Top 0.406: R17.2 21.08,56.28 arc-45 21.16,56.46 21.34,56.64 v22.22,56.64 | CON1.PTA5 50.4,63.5 arc45 50.22,63.43 49.1,62.3 arc-45 48.92,62.23 45.06,62.23 arc45 44.88,62.16 41.48,58.75 40.08,58.75 v37.59,56.26
  Bottom 0.406: v22.22,56.64 22.28,56.59 arc45 22.46,56.52 37.34,56.52 v37.59,56.26
CON2_GPIO_3_2  (via drill 0.4)
  Top 0.406: v18.29,56.77 R18.2 | v12.06,57.78 11.68,58.17 9.78,58.17 9.14,57.53 9.14,54.61 8.25,53.72 8.25,51.56 7.75,51.05 7.75,22.61 10.67,19.68 12.83,19.68 13.84,18.67 16,18.67 v16.51,18.16
  Top 1.016: CON1.PTB0 49.66,16.51 v46.86,16.51
  Bottom 0.406: v46.86,16.51 18.67,16.51 17.02,18.16 v16.51,18.16 | v18.29,56.77 13.08,56.77 v12.06,57.78
CON2_GPIO_3_3
  Top 0.406: CON1.PTB9 20.07,59.56 17.4,59.56 13.84,56.01 R20.2
CON2_GPIO_3_4  (via drill 0.4)
  Top 0.406: R41.1 10.76,42.58 arc-90 v10.67,42.67 | v11.05,52.7 11.81,53.47 11.81,55.5 13.97,57.66 v13.97,58.17
  Bottom 0.406: v10.67,42.67 10.67,52.22 arc-45 10.74,52.4 v11.05,52.7 | CON1.PTA13 40.59,62.3 arc-45 40.41,62.23 28.19,62.23 27.89,61.92 arc45 27.81,61.74 27.81,60.07 27,59.26 arc-45 26.82,59.18 25.27,59.18 24.26,58.17 v13.97,58.17
CON2_I2C0_SCL  (via drill 0.4)
  Top 0.406: 65.41,42.42 66.29,42.42 66.67,42.8 66.67,48.26 67.31,48.9 71.5,48.9 72.14,49.53 72.14,57.78 70.99,58.93 67.69,58.93 65.15,61.47 65.15,63.75 63.25,65.66 50.55,65.66 CON1.PTC8
  Top 0.61: R37.1 22.22,38.99 23.24,37.97 v23.49,37.97 | v65.41,40.64 65.41,42.42 R23.1 | R31.1 v40.01,38.35
  Bottom 0.406: v65.41,40.64 63.5,38.73 40.39,38.73 v40.01,38.35 39.5,37.85 28.96,37.85 28.45,38.35 23.88,38.35 v23.49,37.97
CON2_I2C0_SDA  (via drill 0.4)
  Top 0.406: R30.1 43.9,42.58 v44.2,42.29
  Top 0.61: R36.1 26.5,42.46 arc-90 v26.54,42.42 | R30.1 42.55,40.13 43.94,38.73 66.67,38.73 67.94,40.01 R22.1 71.54,42.58 73.15,44.2 73.15,64.77 71.25,66.67 49.02,66.67 CON1.PTC9
  Bottom 0.406: v26.54,42.42 26.92,42.42 v44.2,42.29
CON2_SOFT_SS_1
  Top 1.016: R15.2 34.92,56.64 CON1.PTC16
CON2_SOFT_SS_2
  Top 0.406: R19.2 15.62,56.77 17.65,58.8 20.57,58.8 21.46,59.69 22.22,59.69 22.73,60.2 22.73,61.85 23.11,62.23 32.26,62.23 32.89,62.87 32.89,64.26 34.8,66.17 41.15,66.17 43.31,64.01 43.31,62.48 CON1.PTC13
CON2_SPI1_HARD_SS  (via drill 0.4)
  Top 0.406: v59.82,60.2 59.82,56.39 60.33,55.88 R9.2
  Bottom 0.406: CON1.PTD4 38.1,64.9 42.16,64.9 44.83,62.23 59.31,62.23 59.82,61.72 v59.82,60.2
CON2_SPI1_MISO  (via drill 0.4)
  Top 0.406: v15.88,38.99 14.86,38.99 13.46,40.39 10.41,40.39 9.02,41.78 9.02,53.21 10.03,54.23 v10.03,57.02
  Top 0.61: R38.1 v19.68,38.99 | v62.86,40.64 R24.1
  Top 1.016: v37.46,38.99 R32.1
  Bottom 0.406: v15.88,38.99 v19.68,38.99 29.08,38.99 29.46,38.61 37.08,38.61 v37.46,38.99 37.85,39.37 61.59,39.37 v62.86,40.64 | v10.03,57.02 10.03,59.05 11.18,60.2 16.38,60.2 18.41,62.23 22.22,62.23 22.73,62.74 22.73,64.9 23.88,66.04 29.08,66.04 CON1.PTD7
CON2_SPI1_MOSI  (via drill 0.4)
  Top 0.406: v7.24,52.2 7.24,54.1 7.87,54.74 v7.87,57.02
  Top 0.61: R39.1 v17.14,40.39 | v34.92,40.39 R33.1 | v60.33,40.77 R25.1
  Bottom 0.406: v60.33,40.77 59.82,40.39 v34.92,40.39 v17.14,40.39 9.78,40.39 7.24,42.93 v7.24,52.2 | v7.87,57.02 9.02,58.17 9.02,62.74 13.21,66.93 30.99,66.93 34.16,63.75 CON1.PTD6
CON2_SPI1_SCK  (via drill 0.4)
  Top 0.406: v11.56,56.77 10.92,56.13 10.92,53.98 9.65,52.7 9.65,42.16 10.54,41.27 v14.61,41.27
  Top 0.61: R40.1 v14.61,41.27 | v57.78,41.27 R26.1
  Top 1.016: v32.38,41.27 R34.1
  Bottom 0.406: v14.61,41.27 v32.38,41.27 v57.78,41.27 | v11.56,56.77 10.92,57.4 10.92,58.55 11.56,59.18 24,59.18 25.27,60.45 25.27,64.64 25.91,65.28 27.3,65.28 CON1.PTD5
CON2_UART0_RX  (via drill 0.4)
  Top 0.406: R29.1 49.24,42.58 48.89,42.93 48.89,48.26 49.4,48.77 v51.44,48.77 | CON1.PTA1 62.36,62.23 62.36,59.94 64.14,58.17 64.14,49.15 63.75,48.77 v59.05,48.77
  Bottom 0.406: v59.05,48.77 v51.44,48.77
CON2_UART0_TX  (via drill 0.4)
  Top 0.406: R12.2 50.16,55.75 v50.42,56.01 | v55.12,56.01 54.74,56.39 54.74,61.59 55.37,62.23 59.82,62.23 CON1.PTA2
  Bottom 0.406: v50.42,56.01 v55.12,56.01
CON3_GPIO_1_1
  Top 1.016: CON1.PTE31 20.19,17.78 17.4,20.57 R48.2
CON3_GPIO_1_2
  Top 0.406: CON1.PTE19 29.21,19.18 20.95,19.18 19.94,20.19 R49.2
CON3_GPIO_1_3
  Top 0.406: CON1.PTE18 32.64,17.78 31.24,19.18 30.48,19.18 29.84,19.81 26.42,19.81 25.02,21.21 R51.2
CON3_GPIO_1_4
  Top 0.406: R68.1 27.98,34.63 28.83,33.78 28.83,21.72 30.73,19.81 31.5,19.81 32.26,19.05 34.42,19.05 CON1.PTE17
CON3_GPIO_1_5
  Top 0.406: R69.1 30.9,34.63 31.37,34.16 31.37,21.72 31.75,21.34 32.77,21.34 33.53,20.57 35.94,20.57 38.23,18.29 CON1.PTE16
CON3_GPIO_1_6
  Top 0.406: CON1.PTE6 39.5,16.51 37.34,16.51 36.96,16.89 36.96,18.41 35.69,19.68 32.77,19.68 31.88,20.57 30.99,20.57 30.1,21.46 R52.2 30.44,22.52
CON3_GPIO_2_1
  Top 1.016: R54.2 42.8,18.29 CON1.PTE3
CON3_GPIO_2_2
  Top 1.016: R55.2 45.34,18.29 CON1.PTE2
CON3_GPIO_2_3
  Top 1.016: R57.2 50.42,18.29 CON1.PTE20
CON3_GPIO_2_4
  Top 0.61: 51.69,24.64 51.69,34.16 52.41,34.89 R76.1
  Top 1.016: CON1.PTE21 53.47,19.05 51.69,20.45 51.69,24.64
CON3_GPIO_3_1
  Top 0.406: 60.58,22.1 R58.2 60.49,22.26 58.93,20.7 57.91,20.7 57.4,20.19 57.4,19.18 CON1.PTE22
CON3_GPIO_3_2
  Top 0.406: CON1.PTE23 59.94,19.18 60.58,19.18 62.48,21.08 62.99,21.08 63.12,21.21 R59.2
CON3_GPIO_3_3
  Top 0.406: CON1.PTB20 61.09,18.29 61.98,19.18 65.28,19.18 66.55,20.45 67.56,20.45 68.2,21.08 R61.2
CON3_GPIO_3_4
  Top 0.406: R82.1 70.78,34.67 71.63,34.67 72.26,34.04 72.26,25.78 71.5,25.02 70.74,25.02 70.1,24.26 70.1,21.46 69.34,20.7 68.83,20.7 67.82,19.68 66.93,19.68 65.66,18.41 64.26,18.41 CON1.PTE30
CON3_I2C_SCL  (via drill 0.4)
  Top 0.406: R78.1 61.51,34.63 61.85,34.29 61.85,29.21 62.61,28.45 63.88,28.45 64.39,27.94 64.39,21.08 v65.15,20.32
  Top 0.61: R63.1 17.44,34.67 v18.67,34.67 | v41.53,34.67 42.8,34.67 R72.1 | v59.31,34.67 60.54,34.67 R78.1
  Bottom 0.406: CON1.PTC1 64.77,15.24 65.15,15.62 v65.15,20.32
  Bottom 0.61: v18.67,34.67 v41.53,34.67 v59.31,34.67
CON3_I2C_SDA  (via drill 0.4)
  Top 0.406: CON1.PTC2 61.09,15.75 60.33,16.51 57.4,16.51 57.28,16.64 57.28,18.16 59.05,19.94 59.94,19.94 61.85,21.84 61.85,27.94 61.34,28.45 57.4,28.45 56.77,29.08 56.77,33.66 v56.64,33.66
  Top 0.61: R62.1 15.53,34.63 v16.13,33.66 | v38.99,33.66 38.99,34.04 39.59,34.63 R71.1 | v56.64,33.66 57.49,34.63 R77.1
  Bottom 0.61: v16.13,33.66 v38.99,33.66 v56.64,33.66
CON3_SOFT_SS_1  (via drill 0.4)
  Top 0.406: R56.2 48.81,22.01 49.15,22.35 49.15,35.94 v48.26,36.83 | v72.77,35.69 76.33,39.24 v76.33,59.56
  Bottom 0.406: v48.26,36.83 63.5,36.83 64.39,35.94 64.39,34.29 64.64,34.04 71.12,34.04 v72.77,35.69 | v76.33,59.56 75.44,60.45 66.55,60.45 65.28,61.72 65.28,64.14 64.64,64.77 57.28,64.77 CON1.PTA12
CON3_SOFT_SS_2  (via drill 0.4)
  Top 0.406: R60.2 66.46,22.26 66.93,22.73 66.93,27.81 67.56,28.45 68.83,28.45 69.47,29.08 69.47,36.2 74.42,41.15 v74.42,59.31
  Bottom 0.406: CON1.PTA7 36.7,59.94 37.34,59.31 v74.42,59.31
CON3_SPI0_HARD_SS  (via drill 0.4)
  Top 0.406: R50.2 23.41,22.52 23.75,22.86 23.75,36.07 24.64,36.96 24.64,40.01 26.06,40.01 arc45 26.24,40.08 28.5,42.34 arc45 28.57,42.52 28.57,51.94 29.52,52.88 arc45 29.59,53.06 29.59,58.55 v28.83,59.31
  Bottom 0.406: v28.83,59.31 29.97,59.31 CON1.PTA14
CON3_SPI0_MISO  (via drill 0.4)
  Top 0.406: CON1.PTA17 24,60.45 21.72,58.17 18.03,58.17 16.89,57.02 16.89,52.45 18.41,50.93 18.41,37.34 v19.94,35.81
  Top 0.61: R64.1 v19.94,35.81 | v45.34,35.81 R73.1 | v63.12,35.81 R79.1
  Bottom 0.406: v45.34,35.81 43.56,35.81 43.31,35.56 21.21,35.56 20.95,35.81 v19.94,35.81
  Bottom 0.61: v45.34,35.81 v63.12,35.81
CON3_SPI0_MOSI  (via drill 0.4)
  Top 0.406: v22.48,36.83 20.95,38.35 20.95,51.31 19.68,52.58 19.68,56.52 20.7,57.53 22.35,57.53 24.64,59.82 25.4,59.82 CON1.PTA16
  Top 0.61: R65.1 v22.48,36.83 | v46.1,36.83 R74.1 | v65.66,35.81 R80.1
  Bottom 0.406: v65.66,35.81 63.5,37.97 47.24,37.97 v46.1,36.83 45.09,37.85 41.66,37.85 41.02,37.21 28.07,37.21 27.81,37.47 25.65,37.47 25.02,36.83 v22.48,36.83
CON3_SPI0_SCK  (via drill 0.4)
  Top 0.406: CON1.PTA15 31.12,58.93 31.12,38.73 28.83,36.45 v27.05,36.45 25.65,36.45 25.02,35.81 R67.1 | v42.55,36.45 43.94,37.85 49.15,37.85 50.42,36.58 R75.1 52.74,36.96 65.87,36.96 R81.1
  Bottom 0.406: v27.05,36.45 v42.55,36.45
CON3_UART2_RX
  Top 0.406: R70.1 32.64,35.81 36.2,39.37 36.2,56.13 39.75,59.69 40.51,59.69 40.51,62.23 CON1.PTD2
CON3_UART2_TX
  Top 0.406: CON1.PTD3 57.15,64.9 52.7,64.9 52.2,64.39 52.2,62.36 52.07,62.23 50.29,62.23 49.66,61.59 49.66,58.42 46.35,55.12 46.35,49.28 45.85,48.77 41.91,48.77 41.27,48.13 41.27,37.59 40.26,36.58 39.62,36.58 34.11,31.06 arc-45 33.93,30.99 33.91,30.99 33.91,22.86 33.57,22.52 R53.2
DEBUG_UART1_RX
  Top 0.406: R83.2 16.13,59.18 17.27,60.33 17.27,61.09 18.92,62.74 CON1.PTE1
DEBUG_UART1_TX
  Top 0.61: R66.2 12.03,64.86 13.97,66.8 18.16,66.8 CON1.PTE0
GND  (via drill 0.4)
  Top 0.61: LED1.C 74.04,14.22 v73.72,13.91 | S2.2 64.48,2.88 63.88,2.29 57.4,2.29 56.73,2.96 S1.2
  Top 1.27: CON_UART.3 3.17,56.64 1.9,57.91 1.9,62.74 7.24,68.07 24.26,68.07 26.54,65.79 CON1.GND | 56.73,6.7 arc-90 v56.77,6.73 56.77,11.94 arc90 S1.1 S1.2 | S2.1 64.48,11.43 | 64.48,11.43 v64.48,6.73 S2.2 | 67.94,11.82 67.55,11.43 64.48,11.43
  Top 1.676: v67.94,6.73 67.94,11.82 v67.95,11.57
  Bottom 0.61: C17.2 28.57,51.7 28.57,48.77 CON2.35 26.03,48.77 26.03,51.67 arc90 C23.2 | C16.2 46.85,51.42 46.35,50.93 46.35,48.77 CON2.21 43.81,48.77 43.81,51.55 C9.2 | C6.2 36.45,25.77 36.45,28.57 37.59,29.72 CON3.21 38.99,28.45 38.99,25.67 C12.2 | C8.2 69.22,51.45 69.22,48.9 70.48,47.62 CON2.1 | C11.2 13.59,25.41 13.59,28.45 CON3.1 | C26.2 56.77,25.8 56.77,28.45 CON3.35 54.23,28.45 54.23,26.29 53.73,25.8 C29.2 | C28.2 v64.48,6.73
  Bottom 0.813: C30.2 C29.2 | C27.2 v56.77,6.73
  Bottom 1.016: C4.2 C17.2 | C3.2 C16.2 | C19.2 C6.2 | C8.2 C21.2 | 70.48,47.62 70.88,48.02 C15.2 C2.2 | CON3.1 arc-90 11.8,29.2 C5.2 C18.2 | C22.2 C9.2 | C23.2 C10.2 | C24.2 C11.2 | C25.2 C12.2 | C13.2 C26.2 | C7.2 C20.2 42.53,14.46 CON1.GND@2 | C1.2 C14.2 47.12,11.57
  Bottom 1.27: CON1.GND@1 CON1.GND@2
  Bottom 1.676: CON2.35 27.3,45.21 28.32,44.2 45.09,44.2 | 70.48,44.32 73.28,44.32 74.55,43.05 74.55,14.73 v73.72,13.91 71.39,11.57 v67.95,11.57 47.12,11.57 45.2,11.57 43.31,13.46 CON1.GND@2 | 70.48,44.32 45.09,44.2 | CON2.1 70.48,44.32 | CON2.21 45.09,44.2 | CON3.1 12.32,31.5 13.21,32 37.72,32 | 37.72,32 55.5,32 | 55.5,32 73.79,32.13 | CON3.21 37.72,32 | CON3.35 55.5,32 | 67.94,6.71 v67.94,6.73
  pour Top (isolate 0.508, no thermals): 0.13,0.13 0.13,71.88 2.79,71.88 81.28,71.88 81.28,69.98 81.28,0.13 76.45,0.13
  pour Bottom (isolate 0.508, no thermals): 0.13,0 0.13,71.75 81.28,71.75 81.28,0
LED_RED
  Top 0.61: CON1.PTB3 59.05,15.24 60.71,13.59 64.14,13.59 65.41,14.86 65.41,17.27 65.79,17.65 66.29,17.65 67.56,18.92 R21.2
N$1
  Top 1.016: R24.2 CON2.7
N$10
  Top 1.016: CON2.6 R7.1
N$12
  Top 1.016: CON2.8 R8.1
N$16
  Top 1.016: CON3.9 R65.2
N$17
  Top 1.016: CON3.5 R63.2
N$18
  Top 1.016: CON3.13 R68.2
N$19
  Top 1.016: CON3.11 R67.2
N$20
  Top 1.016: CON3.15 R69.2
N$21
  Top 1.016: CON2.10 R9.1
N$22
  Top 1.016: CON2.12 R10.1
N$23
  Top 1.016: R11.1 CON2.16
N$24
  Top 1.016: CON3.7 R64.2
N$25
  Top 1.016: CON2.18 R12.1
N$26
  Top 1.016: CON2.26 R13.1
N$27
  Top 1.016: CON3.6 R48.1
N$28
  Top 1.016: CON2.28 R14.1
N$29
  Top 1.016: CON2.30 R15.1
N$30
  Top 1.016: R16.1 CON2.32
N$31
  Top 1.016: R66.1 CON_UART.1
N$32
  Top 1.016: R83.1 CON_UART.2
N$33
  Top 1.016: CON3.8 R49.1
N$34
  Top 0.406: CON2.40 22.22,51.85 R17.1
N$35
  Top 0.61: CON2.44 17.14,50.16 15.62,51.69 R19.1
N$36
  Top 0.406: CON2.42 19.68,51.31 18.29,52.7 R18.1
N$37
  Top 0.61: CON2.46 14.61,50.42 13.84,51.18 R20.1
N$38
  Top 1.016: CON3.10 R50.1
N$40
  Top 1.016: CON3.12 R51.1
N$42
  Top 1.016: CON3.16 R52.1
N$44
  Top 1.016: R53.1 CON3.18
N$46
  Top 1.016: CON3.26 R54.1
N$48
  Top 1.016: CON3.30 R56.1
N$49
  Top 1.016: CON3.28 R55.1
N$50
  Top 1.016: CON3.32 R57.1
N$51
  Top 1.016: CON2.47 R41.2
N$52
  Top 1.016: CON2.45 R40.2
N$53
  Top 1.016: CON2.43 R39.2
N$54
  Top 1.016: CON2.41 R38.2
N$55
  Top 1.016: CON2.39 R37.2
N$56
  Top 1.016: CON2.37 R36.2
N$57
  Top 1.016: CON2.33 R35.2
N$58
  Top 1.016: CON2.31 R34.2
N$59
  Top 1.016: CON2.29 R33.2
N$60
  Top 1.016: CON2.27 R32.2
N$61
  Top 1.016: R31.2 CON2.25
N$62
  Top 1.016: R30.2 CON2.23
N$63
  Top 1.016: R29.2 CON2.17
N$64
  Top 1.016: CON2.13 R27.2
N$65
  Top 1.016: CON2.9 R25.2
N$66
  Top 1.016: CON2.5 R23.2
N$67
  Top 1.016: R22.2 CON2.3
N$68
  Top 1.016: CON2.11 R26.2
N$69
  Top 1.016: CON2.15 R28.2
N$72
  Top 1.016: R58.1 CON3.40
N$74
  Top 1.016: R59.1 CON3.42
N$77
  Top 1.016: R60.1 CON3.44
N$78
  Top 1.016: R61.1 CON3.46
N$80
  Top 1.016: CON3.47 R82.2
N$81
  Top 1.016: CON3.45 R81.2
N$82
  Top 1.016: CON3.43 R80.2
N$83
  Top 1.016: CON3.41 R79.2
N$84
  Top 1.016: CON3.39 R78.2
N$85
  Top 1.016: CON3.37 R77.2
N$86
  Top 1.016: R76.2 53.21,29.97 CON3.33
N$87
  Top 1.016: R75.2 CON3.31
N$88
  Top 1.016: R74.2 CON3.29
N$89
  Top 1.016: R73.2 CON3.27
N$90
  Top 1.016: R72.2 CON3.25
N$91
  Top 1.016: R71.2 CON3.23
N$92
  Top 1.016: CON3.17 R70.2
N$93
  Top 1.016: CON3.3 R62.2
N$103
  Top 0.61: LED1.A 74.04,18.88 R21.1
RESET
  Top 1.27: CON1.RST 33.15,12.95 32.3,12.1 S3.4 S3.3
USER_BUTTON1  (via drill 0.4)
  Top 1.27: S1.4 v52.23,6.73 52.23,6.86 S1.3 53.47,13.21 CON1.PTB1
  Bottom 0.813: C27.1 v52.23,6.73
USER_BUTTON2  (via drill 0.4)
  Top 0.813: CON1.PTB2 57.66,13.59 59.31,13.59 59.98,12.92 S2.3
  Top 1.27: S2.4 v59.98,6.73 59.98,7.49 S2.3
  Bottom 0.61: C28.1 v59.98,6.73

### Text on the board
Top: FRDM v1.0 | www.microhal.org
tStop: FRDM v1.0 | www.microhal.org